# EAGLE design 14A-005 (EAGLE 9.6.2)
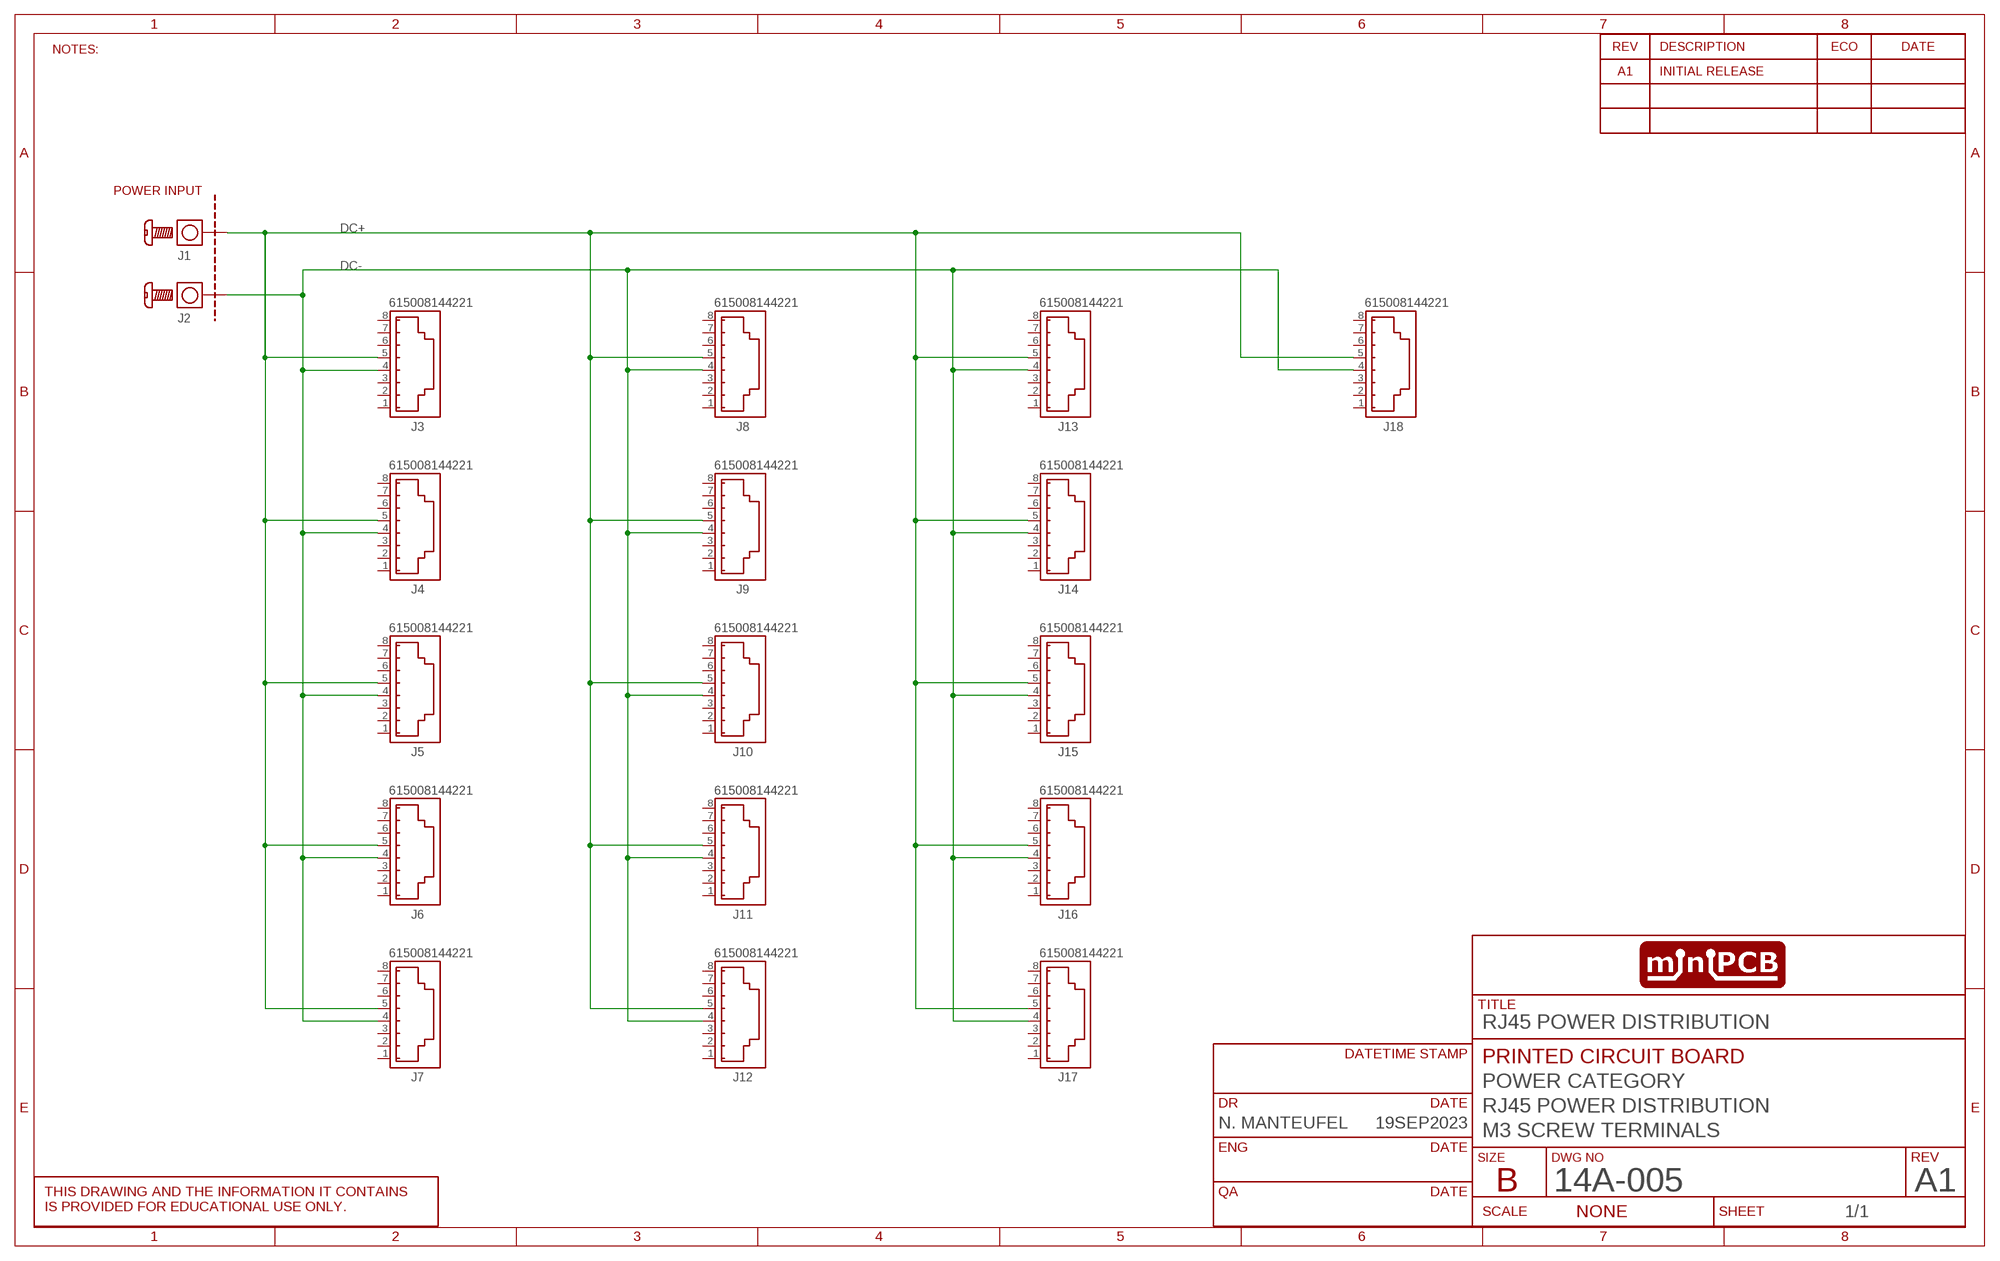
[diagram p0: schematic, sheet 1]
SHEET1 (SCHEMATIC): CIRCUIT_CATEGORY: POWER CATEGORY; CIRCUIT_NAME: RJ45 POWER DISTRIBUTION; CIRCUIT_VARIANT: M3 SCREW TERMINALS; DR: N. MANTEUFEL; DR_DATE: 19SEP2023; PCB_PCBA: PRINTED CIRCUIT BOARD; REVA: A1; REVISION: A1; TITLE: RJ45 POWER DISTRIBUTION

## Parts
-  POWER INPUT  MINIPCB_0P100X100  [MINIPCB_DOCK_100X100]
J1  SCREW-TERMINAL  [SCREW-TERMINAL-M3]
J2  SCREW-TERMINAL  [SCREW-TERMINAL-M3]
J3  615008144221  [615008144221]
J4  615008144221  [615008144221]
J5  615008144221  [615008144221]
J6  615008144221  [615008144221]
J7  615008144221  [615008144221]
J8  615008144221  [615008144221]
J9  615008144221  [615008144221]
J10  615008144221  [615008144221]
J11  615008144221  [615008144221]
J12  615008144221  [615008144221]
J13  615008144221  [615008144221]
J14  615008144221  [615008144221]
J15  615008144221  [615008144221]
J16  615008144221  [615008144221]
J17  615008144221  [615008144221]
J18  615008144221  [615008144221]

## Nets
DC+: J1.1 J1.2 J1.3 J1.4 J3.5 J4.5 J5.5 J6.5 J7.5 J8.5 J9.5 J10.5 J11.5 J12.5 J13.5 J14.5 J15.5 J16.5 J17.5 J18.5
DC-: J2.1 J2.2 J2.3 J2.4 J3.4 J4.4 J5.4 J6.4 J7.4 J8.4 J9.4 J10.4 J11.4 J12.4 J13.4 J14.4 J15.4 J16.4 J17.4 J18.4
Unconnected: J3.1 J3.2 J3.3 J3.6 J3.7 J3.8 J4.1 J4.2 J4.3 J4.6 J4.7 J4.8 J5.1 J5.2 J5.3 J5.6 J5.7 J5.8 J6.1 J6.2 J6.3 J6.6 J6.7 J6.8 J7.1 J7.2 J7.3 J7.6 J7.7 J7.8 J8.1 J8.2 J8.3 J8.6 J8.7 J8.8 J9.1 J9.2 J9.3 J9.6 J9.7 J9.8 J10.1 J10.2 J10.3 J10.6 J10.7 J10.8 J11.1 J11.2 J11.3 J11.6 J11.7 J11.8 J12.1 J12.2 J12.3 J12.6 J12.7 J12.8 J13.1 J13.2 J13.3 J13.6 J13.7 J13.8 J14.1 J14.2 J14.3 J14.6 J14.7 J14.8 J15.1 J15.2 J15.3 J15.6 J15.7 J15.8 J16.1 J16.2 J16.3 J16.6 J16.7 J16.8 J17.1 J17.2 J17.3 J17.6 J17.7 J17.8 J18.1 J18.2 J18.3 J18.6 J18.7 J18.8

## Notes on the sheet
- NOTES:

## Library data of the parts
- = minipcb:MINIPCB_0P; NAME1: RJ45 POWER DISTRIBUTION; PART_NUMBER: 14A-005; REVISION: A1
J1 J2 = minipcb:SCREW-TERMINAL; REVISION: A1
J3-J18 = SIG_CONNECTORS:615008144221: WR-MJ Modular Jack Vertical Plastic 8P8C w. Ears Kind Properties Quality Class:500 Mating cycles General Information Operating Temperature:-40 up to +85 °C Compliance:RoHS Electrical Properties IR 1:1.5 A Working Voltage:120V (AC) Withstanding Voltage:1000V (AC) Contact Resistance:20mΩ RISO:500 MΩ Material Properties Insulator MateriaL:PBT Insulator Flammability Rating:UL94 V-0 Color:Black Contact Material Copper Alloy Contact Plating: Gold Contact Type:Stamped Packaging Properties Packaging:Tray <https://www.we-online.com/catalog/media/o33134v209%20Family_WR-MJ_615008144221.jpg> Details see: https://www.we-online.com/catalog/en/MJ_VERTICAL_PLASTIC_8P8C_W_EARS/ Updated by Ella Wu 2020-06-30 2020(C) Würth Elektronik; DATASHEET-URL: https://www.we-online.com/redexpert/spec/615008144221?ae; MFG1: WURTH ELEKTRONIK; MFG1_PN: 61500814221; MOUNT: THT; PART-NUMBER: 615008144221; TYPE: Vertical; XPXC: 8P8C

## Board
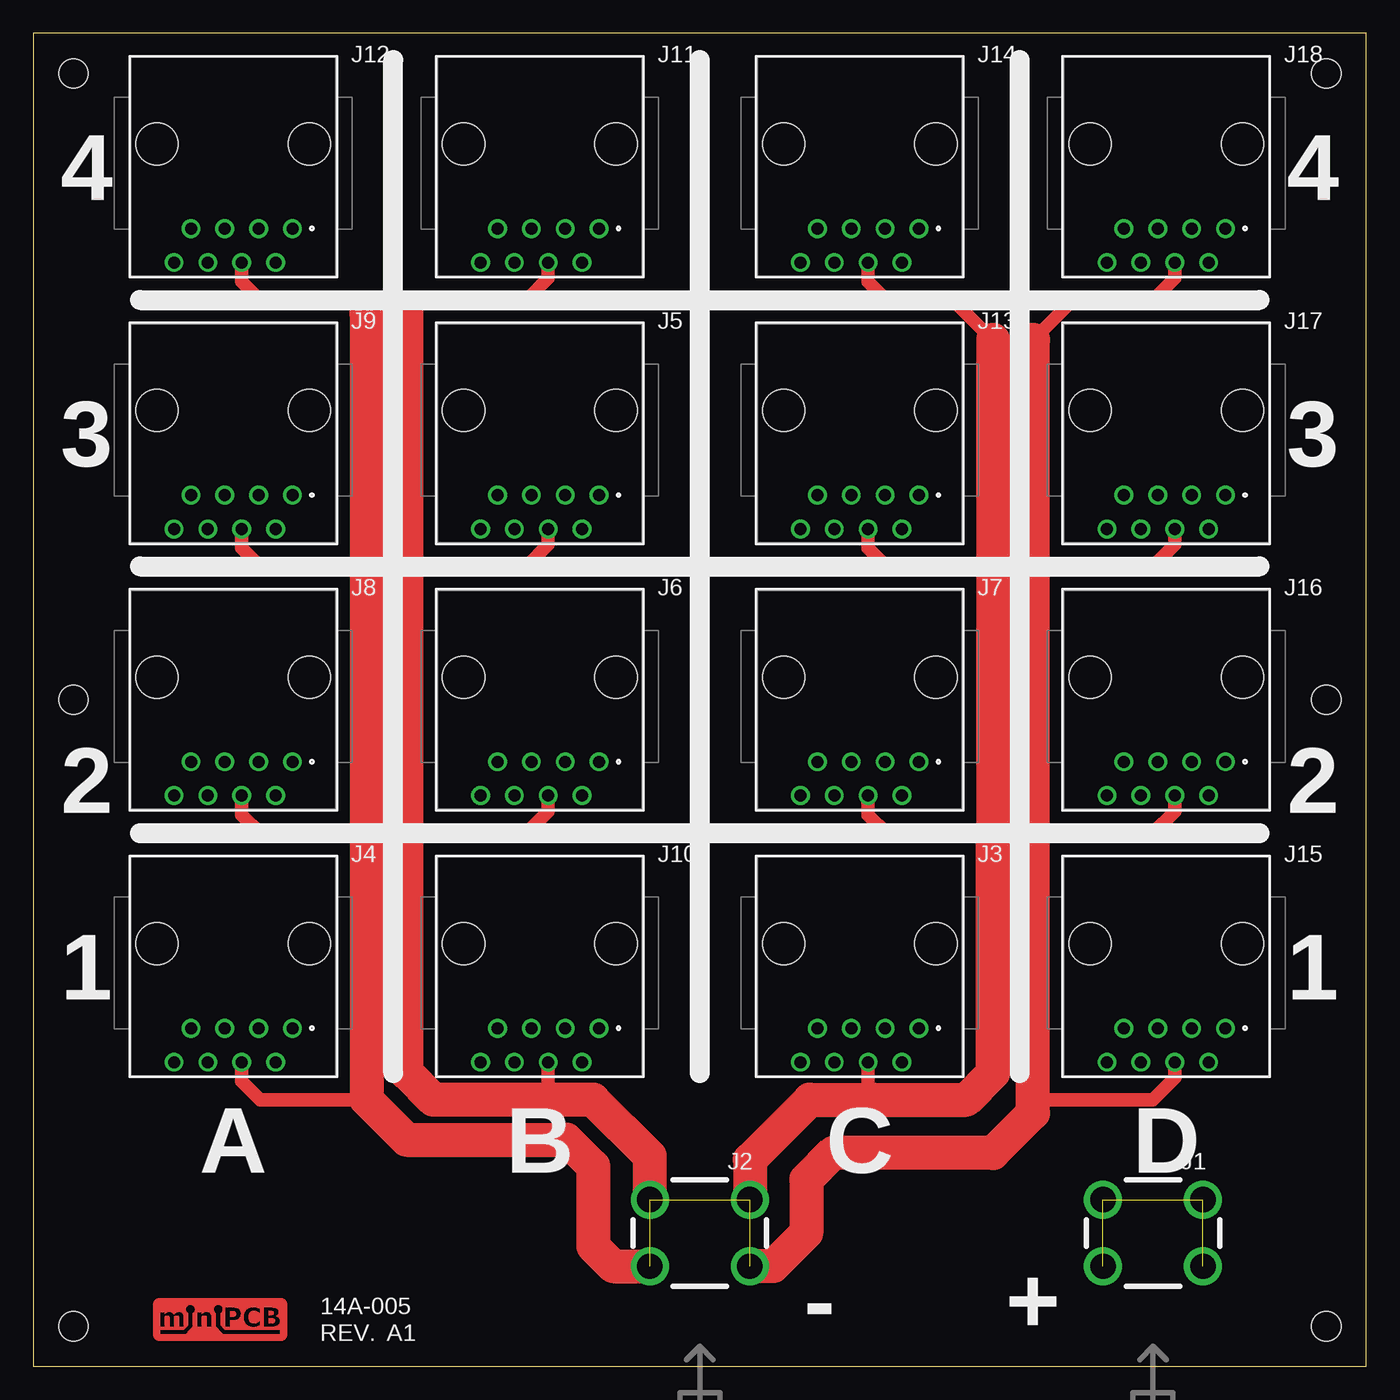
[diagram p1: board, top side]
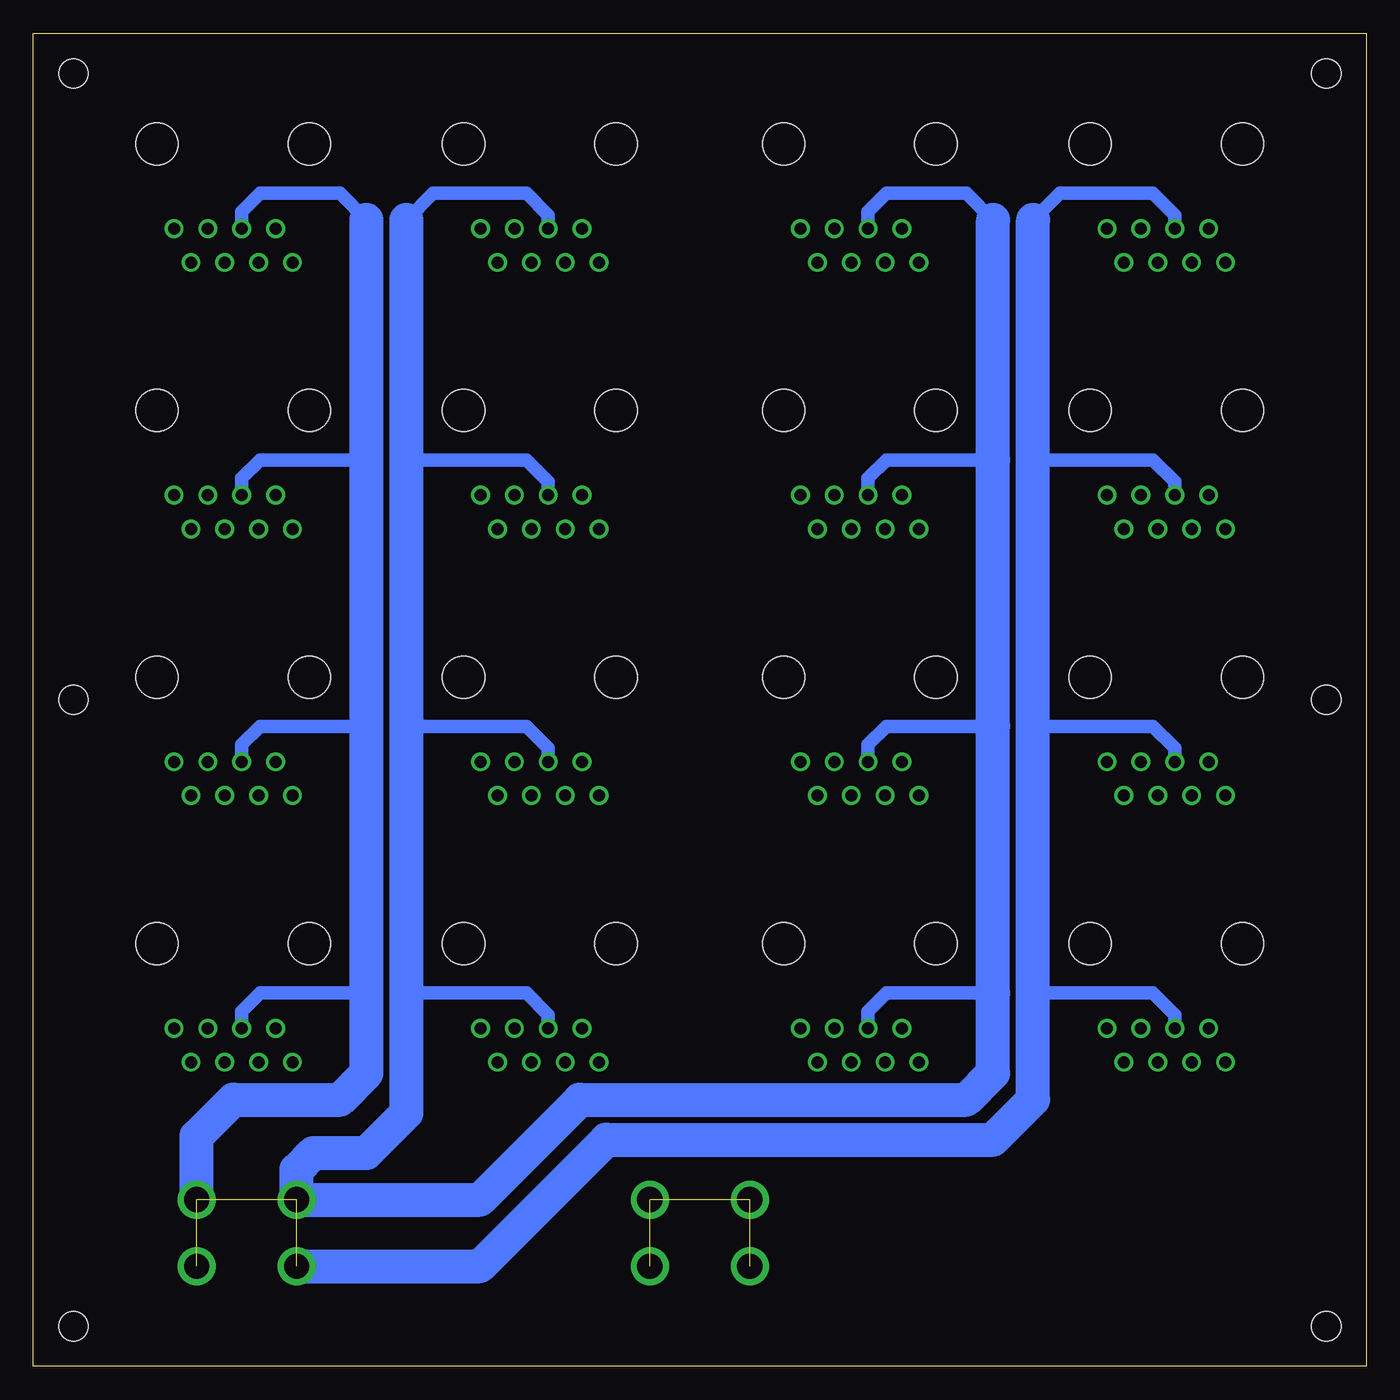
[diagram p2: board, bottom side, seen from below]

Size 100 x 100 mm. Coordinates in mm from the lower left corner, seen from the top.
Outline: 0,0 100,0 100,100 0,100 0,0
Copper layers (1*16): Top 0.035mm / dielectric 0.15mm / Bottom 0.035mm
Design rules "default": minimum track width 6mil, minimum drill 0.35mm, track to track 6mil, track to pad 6mil, pad to pad 6mil, via to via 6mil, smd to smd 6mil, copper to edge 40mil, drill to drill 6mil, minimum pad ring 10mil, minimum via ring 8mil, stop-mask expansion 4mil, vias tented up to drill 0mil, thermal gap 10mil

### Footprints (pad centres in the part's own frame; a part is rotated, then mirrored left to right if it is on the bottom)
MINIPCB_DOCK_100X100 = hole 2.2: 3,97; 3,50; 3,3; 97,3; 97,50; 97,97
SCREW-TERMINAL-M3 = drill 1.9: 1 -2.5,3.75; 2 2.5,3.75; 3 -2.5,-3.75; 4 2.5,-3.75
615008144221 = drill 0.9: 1 4.445,-4.65; 2 3.175,-7.19; 3 1.905,-4.65; 4 0.635,-7.19; 5 -0.635,-4.65; 6 -1.905,-7.19; 7 -3.175,-4.65; 8 -4.445,-7.19 | hole 3.17: 5.715,1.7; -5.715,1.7

### Placement (x,y rotation side)
-  0,0 0 top
J1  84,10 90 top
J2  50,10 90 top
J3  62,30 0 top
J4  15,30 0 top
J5  38,70 0 top
J6  38,50 0 top
J7  62,50 0 top
J8  15,50 0 top
J9  15,70 0 top
J10  38,30 0 top
J11  38,90 0 top
J12  15,90 0 top
J13  62,70 0 top
J14  62,90 0 top
J15  85,30 0 top
J16  85,50 0 top
J17  85,70 0 top
J18  85,90 0 top

### Tracks (layer width: path | path; a pad name or v marks a point on that pad's centre or on a via)
DC+  (3 unrouted)
  Bottom 1: 25,86 23,88 16,88 14.37,86.36 J12.5 | J9.5 14.37,66.36 16,68 25,68 | J8.5 14.37,46.37 16,48 25,48 | J4.5 14.37,26.36 16,28 25,28 | 28,86 30,88 36,88 37.37,86.64 J11.5 | J5.5 37.37,66.64 36,68 28,68 | J6.5 37.37,46.63 36,48 28,48 | J10.5 37.37,26.64 36,28 28,28 | 72,86 70,88 63,88 61.37,86.36 J14.5 | J13.5 61.37,66.36 63,68 72,68 | J7.5 61.37,46.37 63,48 72,48 | J3.5 61.37,26.36 63,28 72,28 | 75,86 77,88 83,88 84.36,86.64 J18.5 | J17.5 84.36,66.64 83,68 75,68 | J16.5 84.36,46.63 83,48 75,48 | J15.5 84.36,26.64 83,28 75,28
  Bottom 2.54: 25,86 25,68 25,48 25,28 25,20 28,17 57,17 66.5,7.5 J1.1 | 28,86 28,68 28,48 28,28 28,22 30,20 59,20 66.5,12.5 J1.2 80.25,14.75 79,16 75,16 72,19 72,28 72,48 72,68 72,86 | J1.4 87.75,17.25 85,20 77,20 75,22 75,28 75,48 75,68 75,86
DC-  (3 unrouted)
  Top 1: J12.4 15.63,81.36 17,80 24,80 25,79 | J4.4 15.63,21.36 17,20 25,20 | J8.4 15.63,41.37 17,40 25,40 | J9.4 15.63,61.37 17,60 25,60 | J14.4 62.63,81.36 64,80 69,80 72,77 | J3.4 62.63,20.36 63,20 | J7.4 62.63,41.37 64,40 72,40 | J13.4 62.63,61.37 64,60 72,60 | 75,77 78,80 84,80 85.64,81.64 J18.4 | J17.4 85.64,61.63 84,60 75,60 | 75,40 84,40 85.64,41.63 J16.4 | 75,19 76,20 84,20 85.64,21.64 J15.4 | 28,79 29,80 37,80 38.63,81.64 J11.4 | 28,60 37,60 38.63,61.63 J5.4 | 28,40 37,40 38.63,41.63 J6.4 | J10.4 38.63,20.64 38,20
  Top 2.54: 25,79 25,60 25,40 25,20 28,17 40,17 42,15 42,9 43.5,7.5 J2.1 | 72,77 72,60 72,40 72,22 70,20 63,20 58.25,20 53.75,15.5 J2.4 | 75,77 75,60 75,40 75,19 72,16 60,16 58,14 58,10 55.5,7.5 J2.3 | J2.2 46.25,15.75 42,20 38,20 30,20 28,22 28,40 28,60 28,79

### Text on the board
tPlace: 4 | 4 | 3 | 3 | 2 | 2 | 1 | 1 | A | B | C | D | - | +